# EAGLE design MOL-v2-1 (EAGLE 8.2.2)
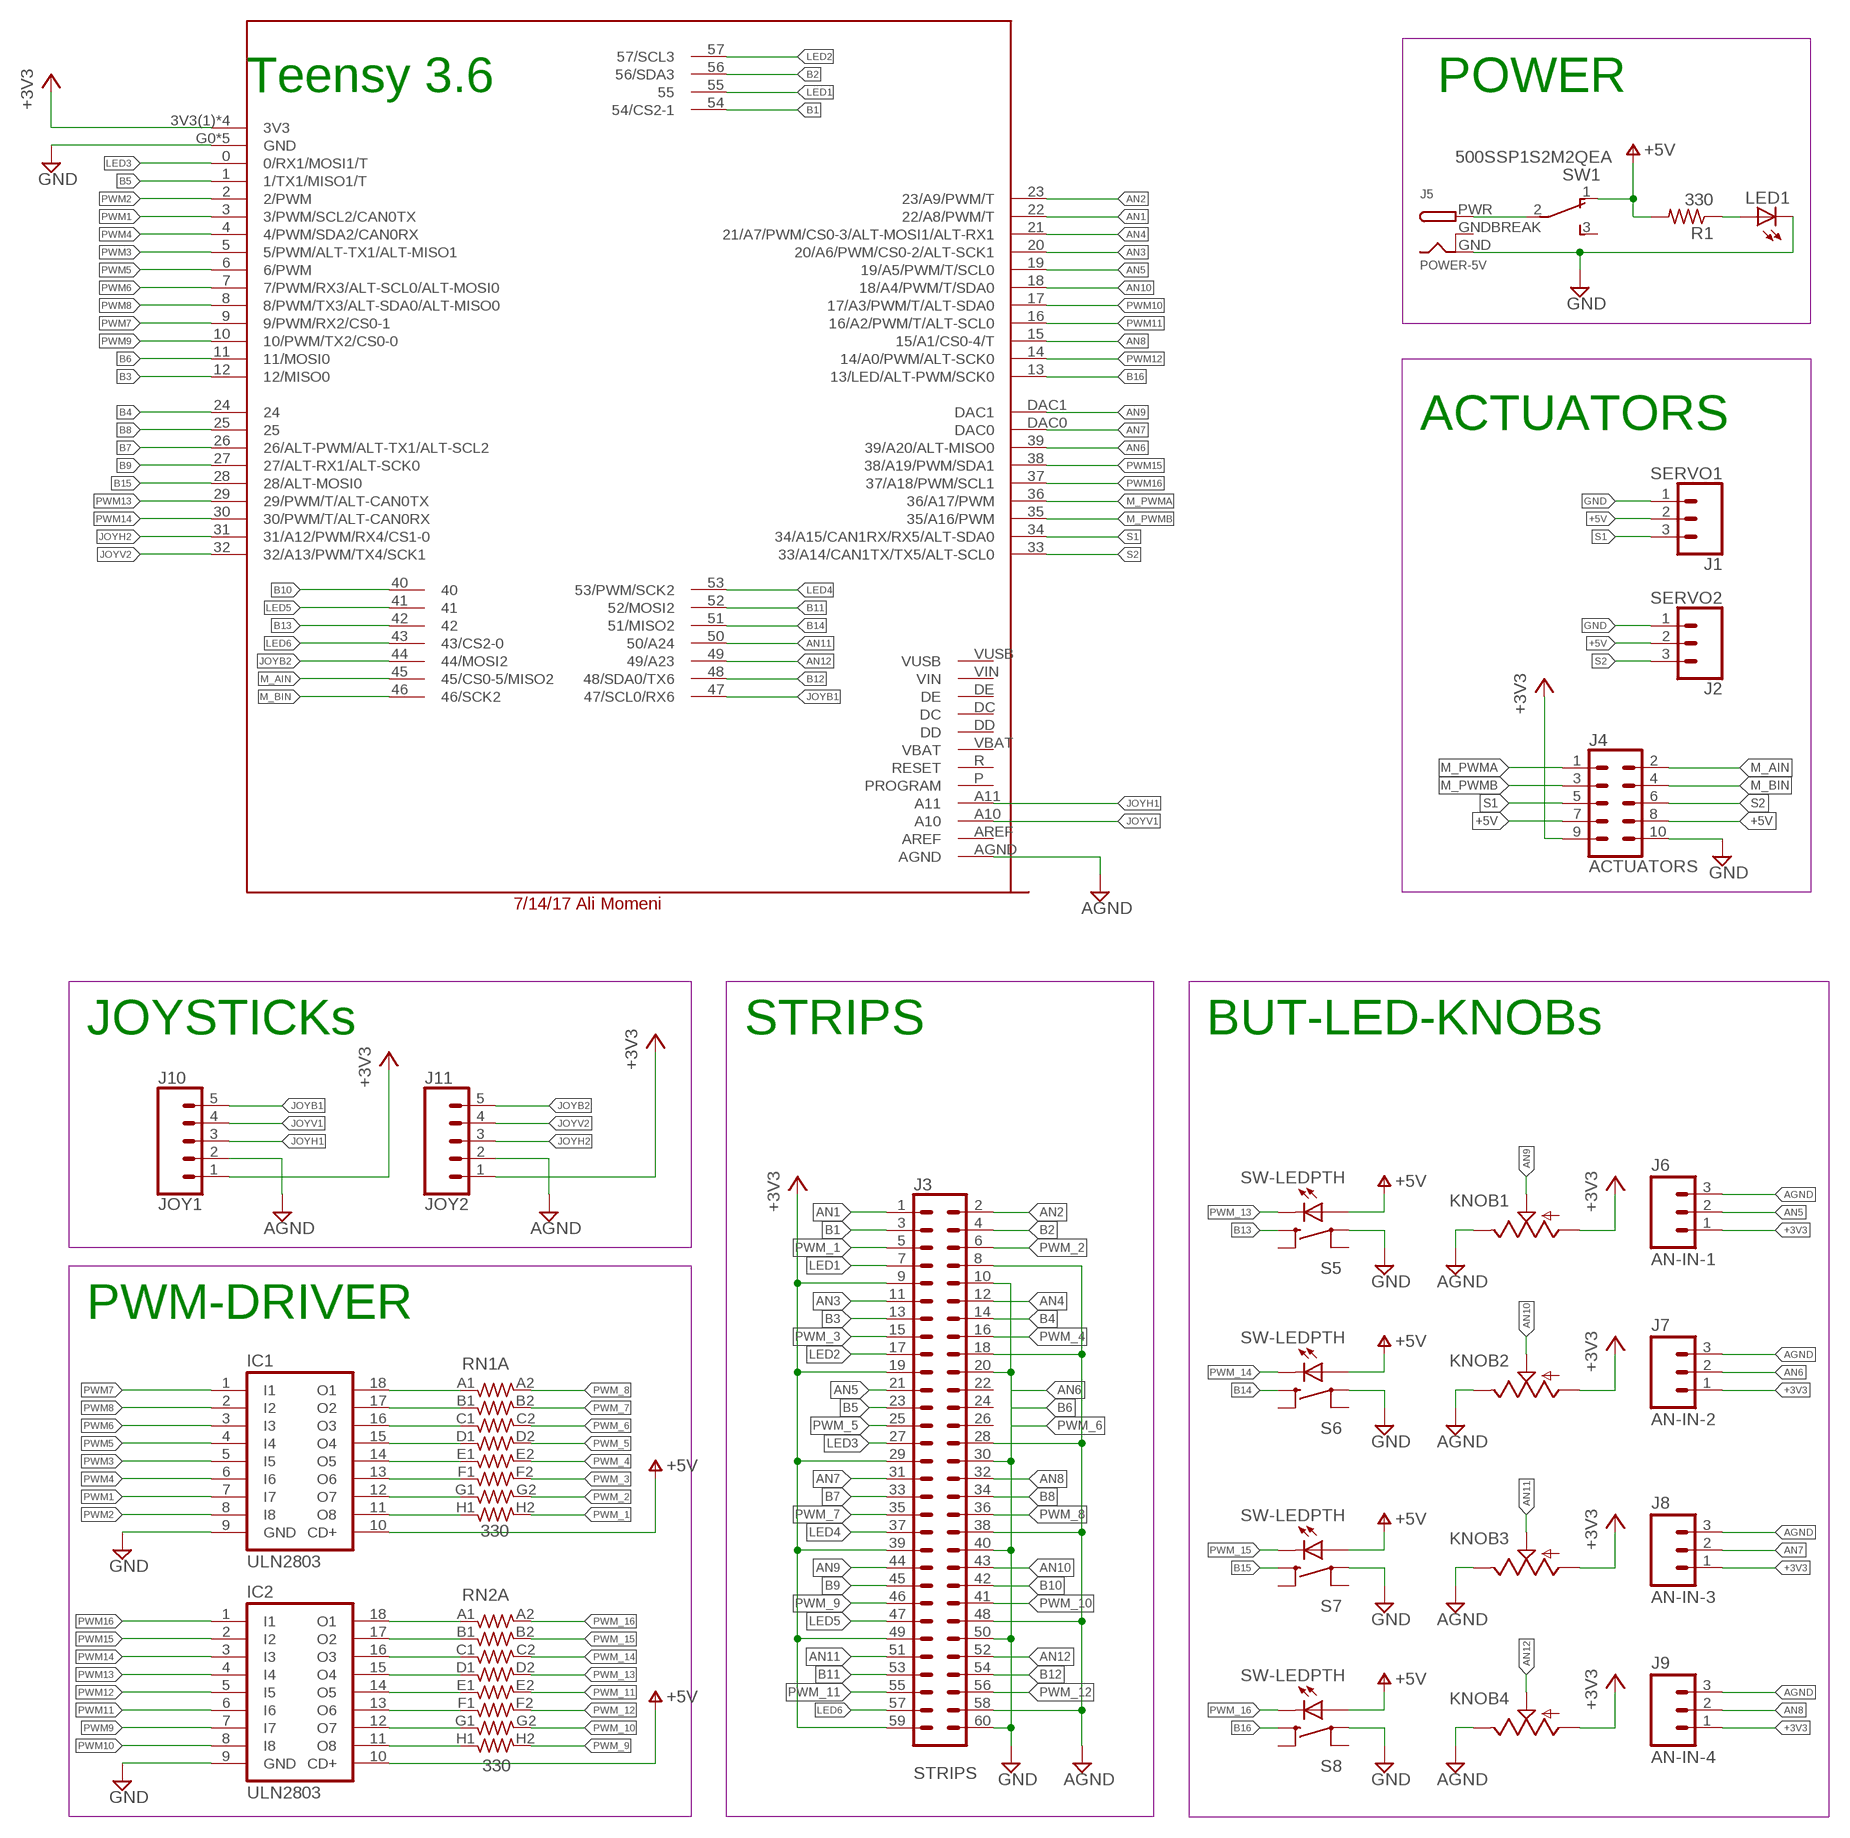
[diagram p0: schematic, sheet 1]

## Parts
IC1  ULN2803  ULN2803A  [DIL18]
IC2  ULN2803  ULN2803A  [DIL18]
J1  SERVO1  CONN_03LOCK  [1X03_LOCK@1]
J2  SERVO2  CONN_03LOCK  [1X03_LOCK@1]
J3  STRIPS  CONN_30X2  [2X30_SHROUDED]
J4  ACTUATORS  CONN_05X2SHD_LOCK  [2X5-SHROUDED_LOCK]
J5  POWER-5V  DCBARRELPTH  [DCJACK_2MM_PTH]
J6  AN-IN-1  M031X03_NO_SILK  [1X03_NO_SILK]
J7  AN-IN-2  M031X03_NO_SILK  [1X03_NO_SILK]
J8  AN-IN-3  M031X03_NO_SILK  [1X03_NO_SILK]
J9  AN-IN-4  M031X03_NO_SILK  [1X03_NO_SILK]
J10  JOY1  CONN_05LOCK  [1X05_LOCK]
J11  JOY2  CONN_05LOCK  [1X05_LOCK]
KNOB1  TRIM  [TRIM-PCB-9MM]
KNOB2  TRIM  [TRIM-PCB-9MM]
KNOB3  TRIM  [TRIM-PCB-9MM]
KNOB4  TRIM  [TRIM-PCB-9MM]
LED1  LED3MM  [LED3MM]
R1  330  R-US_0204/7  [0204/7]
RN1  330  RESISTOR-NET-8PDIL16  [RESISTOR-NET-8P-DIL16]
RN2  330  RESISTOR-NET-8PDIL16  [RESISTOR-NET-8P-DIL16]
S5  SW-LEDPTH  [TR2-SWITCH-MOMENTARY-LED]
S6  SW-LEDPTH  [TR2-SWITCH-MOMENTARY-LED]
S7  SW-LEDPTH  [TR2-SWITCH-MOMENTARY-LED]
S8  SW-LEDPTH  [TR2-SWITCH-MOMENTARY-LED]
SW1  500SSP1S2M2QEA  SWITCH_SPDT500SSP1S2M2QEA  [SWITCH_SPDT_500SSP1S2M2QEA]
U$1  TEENSY3_6-ALI_NO-USB-HOST  [TEENSY3-6_NO-USB-HOST]

## Nets
+3V3: J3.9 J3.19 J3.29 J3.39 J3.49 J3.59 J4.9 J6.1 J7.1 J8.1 J9.1 J10.1 J11.1 KNOB1.1(A) KNOB2.1(A) KNOB3.1(A) KNOB4.1(A) U$1.3V3(1)(3V3) U$1.3V3(2)(3V3) U$1.3V3(3)(3V3) U$1.3V3(4)(3V3)
+5V [Power]: IC1.10(CD+) IC2.10(CD+) J1.2 J2.2 J4.7 J4.8 R1.2 SW1.1 ; supply symbol labelled V+
AGND [Analog Sig]: J3.8 J3.18 J3.28 J3.38 J3.48 J3.58 J6.3 J7.3 J8.3 J9.3 J10.2 J11.2 KNOB1.3(E) KNOB2.3(E) KNOB3.3(E) KNOB4.3(E) U$1.AGND
AN1 [Analog Sig]: J3.1 U$1.22(22/A8/PWM/T)
AN2 [Analog Sig]: J3.2 U$1.23(23/A9/PWM/T)
AN3 [Analog Sig]: J3.11 U$1.20(20/A6/PWM/CS0-2/ALT-SCK1)
AN4 [Analog Sig]: J3.12 U$1.21(21/A7/PWM/CS0-3/ALT-MOSI1/ALT-RX1)
AN5 [Analog Sig]: J3.21 J6.2 U$1.19(19/A5/PWM/T/SCL0)
AN6 [Analog Sig]: J7.2 U$1.39(39/A20/ALT-MISO0)
AN7 [Analog Sig]: J3.31 J8.2 U$1.DAC0
AN8 [Analog Sig]: J3.32 J9.2 U$1.15(15/A1/CS0-4/T)
AN9 [Analog Sig]: J3.44 KNOB1.2(S) U$1.DAC1
AN10 [Analog Sig]: J3.43 KNOB2.2(S) U$1.18(18/A4/PWM/T/SDA0)
AN11 [Analog Sig]: J3.51 KNOB3.2(S) U$1.50(50/A24)
AN12 [Analog Sig]: J3.52 KNOB4.2(S) U$1.49(49/A23)
B1: J3.3 U$1.54(54/CS2-1)
B2: J3.4 U$1.56(56/SDA3)
B3: J3.13 U$1.12(12/MISO0)
B4: J3.14 U$1.24
B5: J3.23 U$1.1(1/TX1/MISO1/T)
B6: U$1.11(11/MOSI0)
B7: J3.33 U$1.26(26/ALT-PWM/ALT-TX1/ALT-SCL2)
B8: J3.34 U$1.25
B9: J3.45 U$1.27(27/ALT-RX1/ALT-SCK0)
B10: J3.42 U$1.40
B11: J3.53 U$1.52(52/MOSI2)
B12: J3.54 U$1.48(48/SDA0/TX6)
B13: S5.1 U$1.42
B14: S6.1 U$1.51(51/MISO2)
B15: S7.1 U$1.28(28/ALT-MOSI0)
B16: S8.1 U$1.13(13/LED/ALT-PWM/SCK0)
GND: IC1.9(GND) IC2.9(GND) J1.1 J2.1 J3.10 J3.20 J3.30 J3.40 J3.50 J3.60 J4.10 J5.GND LED1.K(C) S5.3 S6.3 S7.3 S8.3 U$1.G0(GND) U$1.G1(GND) U$1.G2(GND) U$1.G3(GND) U$1.G6(GND)
JOYB1: J10.5 U$1.47(47/SCL0/RX6)
JOYB2: J11.5 U$1.44(44/MOSI2)
JOYH1 [Analog Sig]: J10.3 U$1.A11
JOYH2 [Analog Sig]: J11.3 U$1.31(31/A12/PWM/RX4/CS1-0)
JOYV1 [Analog Sig]: J10.4 U$1.A10
JOYV2 [Analog Sig]: J11.4 U$1.32(32/A13/PWM/TX4/SCK1)
LED1: J3.7 U$1.55
LED2: J3.17 U$1.57(57/SCL3)
LED3: J3.27 U$1.0(0/RX1/MOSI1/T)
LED4: J3.37 U$1.53(53/PWM/SCK2)
LED5: J3.47 U$1.41
LED6: J3.57 U$1.43(43/CS2-0)
M_AIN: J4.2 U$1.45(45/CS0-5/MISO2)
M_BIN: J4.4 U$1.46(46/SCK2)
M_PWMA: J4.1 U$1.36(36/A17/PWM)
M_PWMB: J4.3 U$1.35(35/A16/PWM)
N$1: J5.PWR SW1.2
N$2: LED1.A R1.1
N$11: IC1.18(O1) RN1.A1
N$12: IC1.17(O2) RN1.B1
N$13: IC1.16(O3) RN1.C1
N$14: IC1.15(O4) RN1.D1
N$15: IC1.14(O5) RN1.E1
N$16: IC1.13(O6) RN1.F1
N$17: IC1.12(O7) RN1.G1
N$18: IC1.11(O8) RN1.H1
N$19: IC2.18(O1) RN2.A1
N$20: IC2.17(O2) RN2.B1
N$21: IC2.16(O3) RN2.C1
N$22: IC2.15(O4) RN2.D1
N$23: IC2.14(O5) RN2.E1
N$24: IC2.12(O7) RN2.G1
N$25: IC2.11(O8) RN2.H1
N$26: IC2.13(O6) RN2.F1
PWM1: IC1.7(I7) U$1.3(3/PWM/SCL2/CAN0TX)
PWM2: IC1.8(I8) U$1.2(2/PWM)
PWM3: IC1.5(I5) U$1.5(5/PWM/ALT-TX1/ALT-MISO1)
PWM4: IC1.6(I6) U$1.4(4/PWM/SDA2/CAN0RX)
PWM5: IC1.4(I4) U$1.6(6/PWM)
PWM6: IC1.3(I3) U$1.7(7/PWM/RX3/ALT-SCL0/ALT-MOSI0)
PWM7: IC1.1(I1) U$1.9(9/PWM/RX2/CS0-1)
PWM8: IC1.2(I2) U$1.8(8/PWM/TX3/ALT-SDA0/ALT-MISO0)
PWM9: IC2.7(I7) U$1.10(10/PWM/TX2/CS0-0)
PWM10: IC2.8(I8) U$1.17(17/A3/PWM/T/ALT-SDA0)
PWM11: IC2.6(I6) U$1.16(16/A2/PWM/T/ALT-SCL0)
PWM12: IC2.5(I5) U$1.14(14/A0/PWM/ALT-SCK0)
PWM13: IC2.4(I4) U$1.29(29/PWM/T/ALT-CAN0TX)
PWM14: IC2.3(I3) U$1.30(30/PWM/T/ALT-CAN0RX)
PWM15: IC2.2(I2) U$1.38(38/A19/PWM/SDA1)
PWM16: IC2.1(I1) U$1.37(37/A18/PWM/SCL1)
PWM_1: J3.5 RN1.H2
PWM_2: J3.6 RN1.G2
PWM_3: J3.15 RN1.F2
PWM_4: J3.16 RN1.E2
PWM_5: J3.25 RN1.D2
PWM_6: RN1.C2
PWM_7: J3.35 RN1.B2
PWM_8: J3.36 RN1.A2
PWM_9: J3.46 RN2.H2
PWM_10: J3.41 RN2.G2
PWM_11: J3.55 RN2.E2
PWM_12: J3.56 RN2.F2
PWM_13: RN2.D2 S5.C
PWM_14: RN2.C2 S6.C
PWM_15: RN2.B2 S7.C
PWM_16: RN2.A2 S8.C
S1: J1.3 J4.5 U$1.34(34/A15/CAN1RX/RX5/ALT-SDA0)
S2: J2.3 J4.6 U$1.33(33/A14/CAN1TX/TX5/ALT-SCL0)
V+: S5.A S6.A S7.A S8.A
Unconnected: J3.22 J3.24 J3.26 S5.2 S5.4 S6.2 S6.4 S7.2 S7.4 S8.2 S8.4 SW1.3 U$1.AREF U$1.DC U$1.DD U$1.DE U$1.P(PROGRAM) U$1.R(RESET) U$1.VBAT U$1.VIN U$1.VUSB

## Notes on the sheet
- Teensy 3.6 | POWER
- ACTUATORS
- JOYSTICKs | STRIPS | BUT-LED-KNOBs
- PWM-DRIVER

## Power pins joined to a net without a drawn wire
GNDBREAK: J5.GNDBREAK

## Library data of the parts
IC1 IC2 = uln-udn:ULN2803A: DRIVER ARRAY
J1 J2 = SparkFun-Connectors:CONN_03: Multi connection point. Often used as Generic Header-pin footprint for 0.1 inch spaced/style header connections On any of the 0.1 inch spaced packages, you can populate with these: Break Away Headers - Straight <https://www.sparkfun.com/products/116> (PRT-00116) Break Away Male Headers - Right Angle <https://www.sparkfun.com/products/553> (PRT-00553) Female Headers <https://www.sparkfun.com/products/115> (PRT-00115) Break Away Headers - Machine Pin <https://www.sparkfun.com/products/117> (PRT-00117) Break Away Female Headers - Swiss Machine Pin <https://www.sparkfun.com/products/743> (PRT-00743) Stackable Header - 3 Pin (Female, 0.1") <https://www.sparkfun.com/products/13875> (PRT-13875) For SCREWTERMINALS and SPRING TERMINALS visit here: Screw Terimnals on SparkFun.com <https://www.sparkfun.com/search/results?term=Screw+Terminals> (5mm/3.5mm/2.54mm spacing) This device is also useful as a general connection point to wire up your design to another part of your project. Our various solder wires solder well into these plated through hole pads. Hook-Up Wire - Assortment (Stranded, 22 AWG) <https://www.sparkfun.com/products/11375> (PRT-11375) Hook-Up Wire - Assortment (Solid Core, 22 AWG) <https://www.sparkfun.com/products/11367> (PRT-11367) View the entire wire category on our website here <https://www.sparkfun.com/categories/141> Special notes: Molex polarized connector foot print use with SKU : PRT-08232 with associated crimp pins and housings.
J3 = CMU-ArtFab:CONN_30X2
J4 = SparkFun-Connectors:CONN_05X2: Multi connection point. Often used as Generic Header-pin footprint for 0.1 inch spaced/style header connections For AVR SPI programming port, see special device with nice symbol: "AVR_SPI_PROG_5x2.dev" You can populate with any combo of single row headers, but if you'd like an exact match, check these: 2x5 AVR ICSP Male Header <https://www.sparkfun.com/products/778> (PRT-00778) 2x5 Pin Shrouded Header <https://www.sparkfun.com/products/8506> (PRT-08506) On any of the 0.1 inch spaced packages, you can populate with these: Break Away Headers - Straight <https://www.sparkfun.com/products/116> (PRT-00116) Break Away Male Headers - Right Angle <https://www.sparkfun.com/products/553> (PRT-00553) Female Headers <https://www.sparkfun.com/products/115> (PRT-00115) Break Away Headers - Machine Pin <https://www.sparkfun.com/products/117> (PRT-00117) Break Away Female Headers - Swiss Machine Pin <https://www.sparkfun.com/products/743> (PRT-00743) Special note: the shrouded connector mates well with our 5x2 ribbon cables: 2x5 Pin IDC Ribbon Cable <https://www.sparkfun.com/products/8535> (PRT-08535); PROD_ID: CONN-08671; SF_ID: PRT-08506
J5 = adafruit:DCBARREL: 2.0mm DC Barrel Jack DCJACK_2MM_PTH - Through Hole Jack (4UConnector: 05537)
J6-J9 = SparkFun-Connectors:M03: Header 3 Standard 3-pin 0.1" header. Use with straight break away headers (SKU : PRT-00116), right angle break away headers (PRT-00553), swiss pins (PRT-00743), machine pins (PRT-00117), and female headers (PRT-00115). Molex polarized connector foot print use with SKU : PRT-08232 with associated crimp pins and housings.
J10 J11 = SparkFun-Connectors:CONN_05: Multi connection point. Often used as Generic Header-pin footprint for 0.1 inch spaced/style header connections On any of the 0.1 inch spaced packages, you can populate with these: Break Away Headers - Straight <https://www.sparkfun.com/products/116> (PRT-00116) Break Away Male Headers - Right Angle <https://www.sparkfun.com/products/553> (PRT-00553) Female Headers <https://www.sparkfun.com/products/115> (PRT-00115) Break Away Headers - Machine Pin <https://www.sparkfun.com/products/117> (PRT-00117) Break Away Female Headers - Swiss Machine Pin <https://www.sparkfun.com/products/743> (PRT-00743) For SCREWTERMINALS and SPRING TERMINALS visit here: Screw Terimnals on SparkFun.com <https://www.sparkfun.com/search/results?term=Screw+Terminals> (5mm/3.5mm/2.54mm spacing) This device is also useful as a general connection point to wire up your design to another part of your project. Our various solder wires solder well into these plated through hole pads. Hook-Up Wire - Assortment (Stranded, 22 AWG) <https://www.sparkfun.com/products/11375> (PRT-11375) Hook-Up Wire - Assortment (Solid Core, 22 AWG) <https://www.sparkfun.com/products/11367> (PRT-11367) View the entire wire category on our website here <https://www.sparkfun.com/categories/141> Special notes: Molex polarized connector foot print use with SKU : PRT-08231 with associated crimp pins and housings. 1MM SMD Version SKU: PRT-10208
KNOB1-KNOB4 = Daniel:TRIM
LED1 = led:LED: LED OSRAM: - CHIPLED LG R971, LG N971, LY N971, LG Q971, LY Q971, LO R971, LY R971 LH N974, LH R974 LS Q976, LO Q976, LY Q976 LO Q996 - Hyper CHIPLED LW Q18S LB Q993, LB Q99A, LB R99A - SideLED LS A670, LO A670, LY A670, LG A670, LP A670 LB A673, LV A673, LT A673, LW A673 LH A674 LY A675 LS A676, LA A676, LO A676, LY A676, LW A676 LS A679, LY A679, LG A679 - Hyper Micro SIDELED® LS Y876, LA Y876, LO Y876, LY Y876 LT Y87S - SmartLED LW L88C, LW L88S LB L89C, LB L89S, LG L890 LS L89K, LO L89K, LY L89K LS L896, LA L896, LO L896, LY L896 - TOPLED LS T670, LO T670, LY T670, LG T670, LP T670 LSG T670, LSP T670, LSY T670, LOP T670, LYG T670 LG T671, LOG T671, LSG T671 LB T673, LV T673, LT T673, LW T673 LH T674 LS T676, LA T676, LO T676, LY T676, LB T676, LH T676, LSB T676, LW T676 LB T67C, LV T67C, LT T67C, LS T67K, LO T67K, LY T67K, LW E67C LS E67B, LA E67B, LO E67B, LY E67B, LB E67C, LV E67C, LT E67C LW T67C LS T679, LY T679, LG T679 LS T770, LO T770, LY T770, LG T770, LP T770 LB T773, LV T773, LT T773, LW T773 LH T774 LS E675, LA E675, LY E675, LS T675 LS T776, LA T776, LO T776, LY T776, LB T776 LHGB T686 LT T68C, LB T68C - Hyper Mini TOPLED® LB M676 - Mini TOPLED Santana® LG M470 LS M47K, LO M47K, LY M47K Source: http://www.osram.convergy.de LUXEON: - LUMILED® LXK2-PW12-R00, LXK2-PW12-S00, LXK2-PW14-U00, LXK2-PW14-V00 LXK2-PM12-R00, LXK2-PM12-S00, LXK2-PM14-U00 LXK2-PE12-Q00, LXK2-PE12-R00, LXK2-PE12-S00, LXK2-PE14-T00, LXK2-PE14-U00 LXK2-PB12-K00, LXK2-PB12-L00, LXK2-PB12-M00, LXK2-PB14-N00, LXK2-PB14-P00, LXK2-PB14-Q00 LXK2-PR12-L00, LXK2-PR12-M00, LXK2-PR14-Q00, LXK2-PR14-R00 LXK2-PD12-Q00, LXK2-PD12-R00, LXK2-PD12-S00 LXK2-PH12-R00, LXK2-PH12-S00 LXK2-PL12-P00, LXK2-PL12-Q00, LXK2-PL12-R00 Source: www.luxeon.com KINGBRIGHT: KA-3528ASYC Source: www.kingbright.com
R1 = resistor:R-US_: RESISTOR, American symbol
RN1 RN2 = CMU-ArtFab:RESISTOR-NET-8P: CTS 742 Series 16 Terminations, 8 Resistors
S5-S8 = Daniel:SW-LED: SWITCH PUSH SPST-NO 10MA 12V
SW1 = CMU-ArtFab:SWITCH_SPDT; DIGIKEY: EG5137-ND
U$1 = CMU-ArtFab:TEENSY3_6-ALI_NO-USB-HOST

## Net classes
2 Power: width 0.381 mm, clearance 0.279 mm
3 Analog Sig: width 0.381 mm, clearance 0.279 mm

## Board
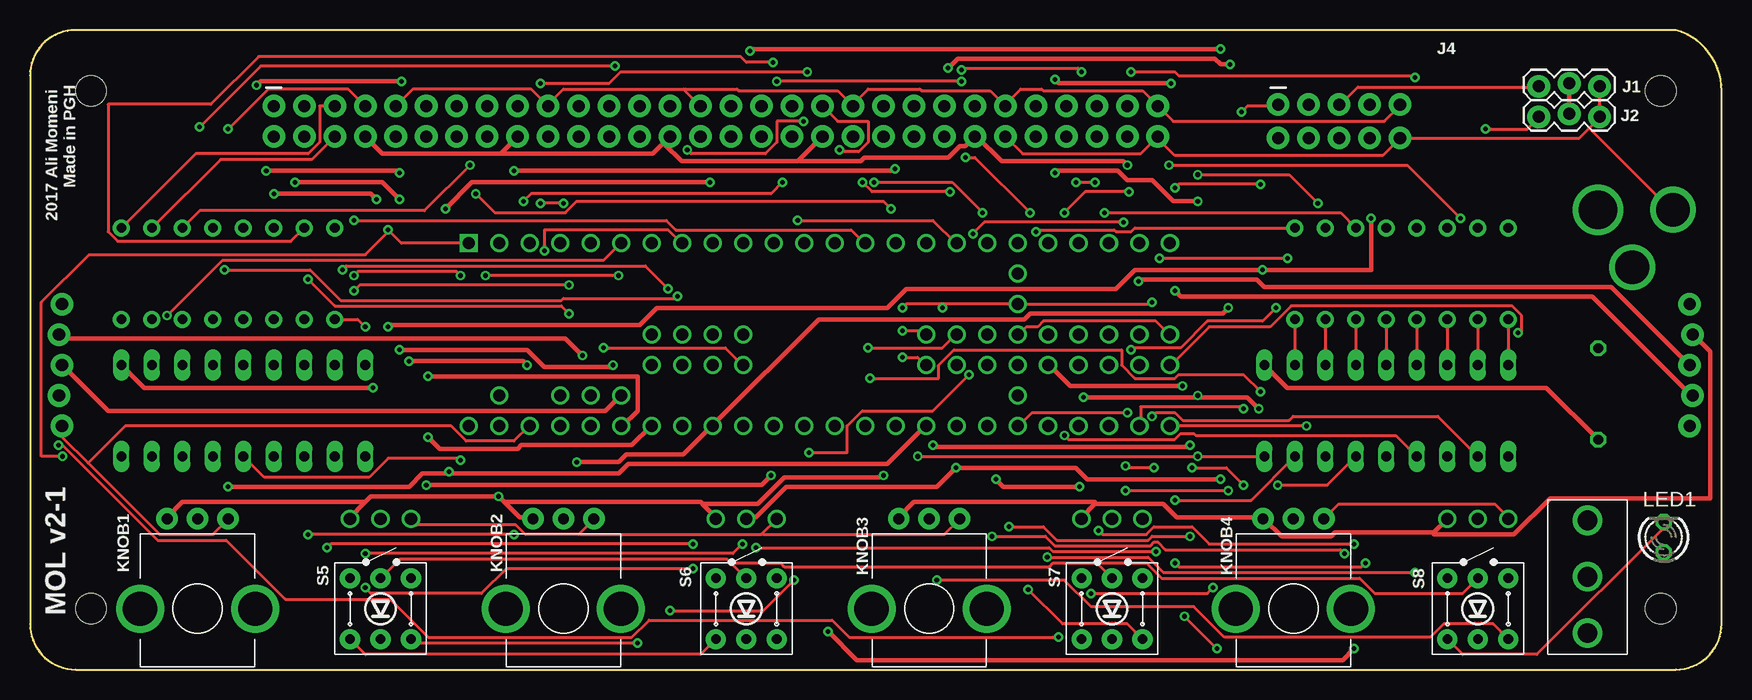
[diagram p1: board, top side]
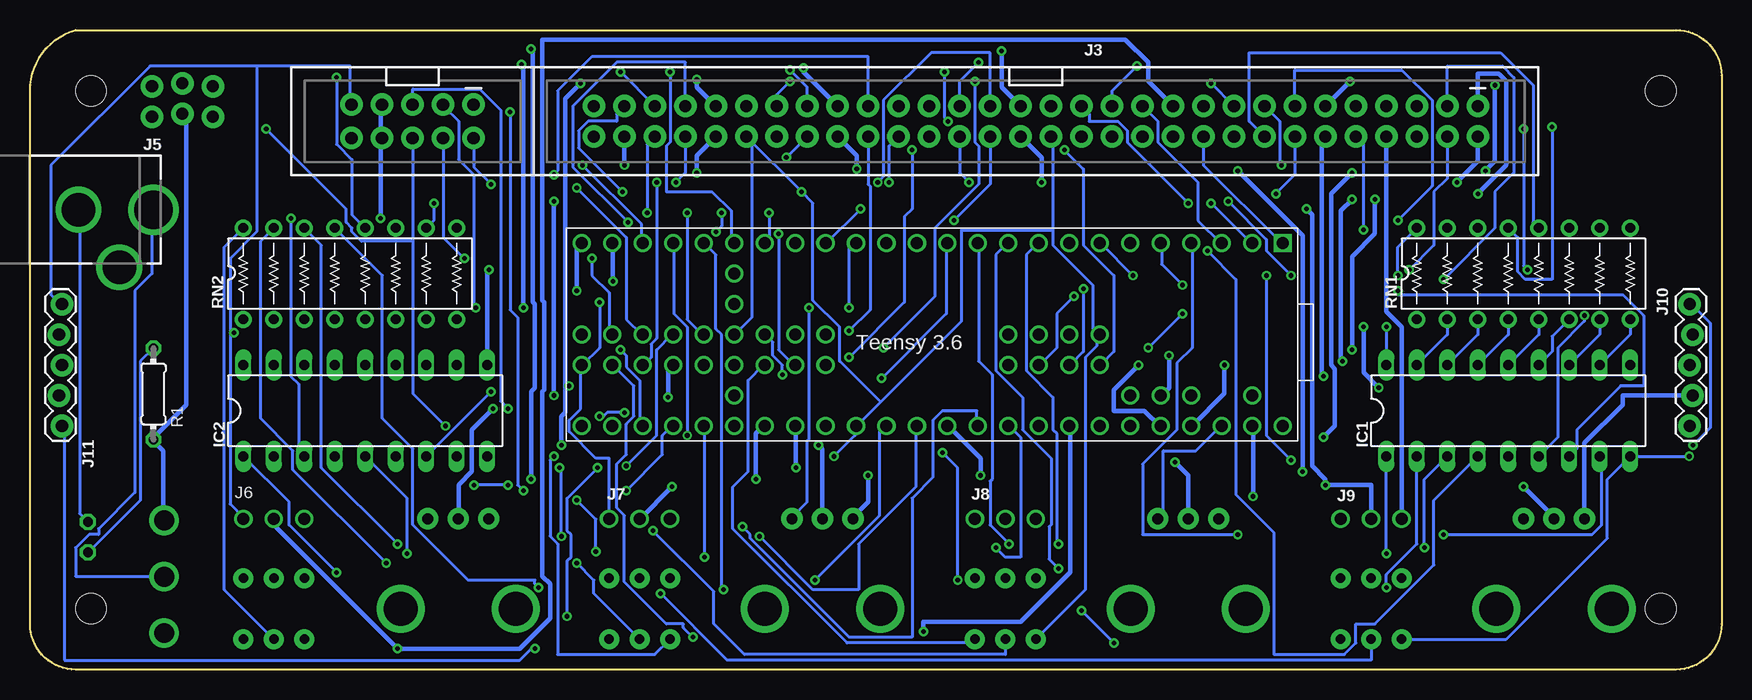
[diagram p2: board, bottom side, seen from below]

Size 140.97 x 53.34 mm. Coordinates in mm from the lower left corner, seen from the top.
Outline: 3.81,53.34 arc90 0,49.53 0,3.81 arc90 3.81,0 137.16,0 arc90 140.97,3.81 140.97,48.26 arc74 137.16,53.34 3.81,53.34
Copper layers (1*16): Top 0.035559375mm / dielectric 1.501140625mm / Bottom 0.035559375mm
Design rules "typical_4pcb": minimum track width 10mil, minimum drill 15mil, track to track 6mil, track to pad 6mil, pad to pad 6mil, via to via 6mil, smd to smd 6mil, copper to edge 15mil, drill to drill 8mil, minimum pad ring 10mil, minimum via ring 8mil, stop-mask expansion 4mil, vias tented up to drill 0mil, thermal gap 10mil
Holes 2.54 mm at 5.08,48.26 135.89,48.26 135.89,5.08 5.08,5.08

### Footprints (pad centres in the part's own frame; a part is rotated, then mirrored left to right if it is on the bottom)
DIL18 = drill 0.813 long: 1 -10.16,-3.81; 2 -7.62,-3.81; 3 -5.08,-3.81; 4 -2.54,-3.81; 5 0,-3.81; 6 2.54,-3.81; 7 5.08,-3.81; 8 7.62,-3.81; 9 10.16,-3.81; 10 10.16,3.81; 11 7.62,3.81; 12 5.08,3.81; 13 2.54,3.81; 14 0,3.81; 15 -2.54,3.81; 16 -5.08,3.81; 17 -7.62,3.81; 18 -10.16,3.81
1X03_LOCK@1 = drill 1.016 pad 1.88: 1 0,0.127; 2 2.54,-0.127; 3 5.08,0.127
2X30_SHROUDED = drill 1.016 pad 1.88: 1 -1.27,36.83; 2 1.27,36.83; 3 -1.27,34.29; 4 1.27,34.29; 5 -1.27,31.75; 6 1.27,31.75; 7 -1.27,29.21; 8 1.27,29.21; 9 -1.27,26.67; 10 1.27,26.67; 11 -1.27,24.13; 12 1.27,24.13; 13 -1.27,21.59; 14 1.27,21.59; 15 -1.27,19.05; 16 1.27,19.05; 17 -1.27,16.51; 18 1.27,16.51; 19 -1.27,13.97; 20 1.27,13.97; 21 -1.27,11.43; 22 1.27,11.43; 23 -1.27,8.89; 24 1.27,8.89; 25 -1.27,6.35; 26 1.27,6.35; 27 -1.27,3.81; 28 1.27,3.81; 29 -1.27,1.27; 30 1.27,1.27; 31 -1.27,-1.27; 32 1.27,-1.27; 33 -1.27,-3.81; 34 1.27,-3.81; 35 -1.27,-6.35; 36 1.27,-6.35; 37 -1.27,-8.89; 38 1.27,-8.89; 39 -1.27,-11.43; 40 1.27,-11.43; 41 -1.27,-13.97; 42 1.27,-13.97; 43 -1.27,-16.51; 44 1.27,-16.51; 45 -1.27,-19.05; 46 1.27,-19.05; 47 -1.27,-21.59; 48 1.27,-21.59; 49 -1.27,-24.13; 50 1.27,-24.13; 51 -1.27,-26.67; 52 1.27,-26.67; 53 -1.27,-29.21; 54 1.27,-29.21; 55 -1.27,-31.75; 56 1.27,-31.75; 57 -1.27,-34.29; 58 1.27,-34.29; 59 -1.27,-36.83; 60 1.27,-36.83
2X5-SHROUDED_LOCK = drill 1.016 pad 1.88: 1 -1.397,5.08; 2 1.397,5.08; 3 -1.397,2.54; 4 1.397,2.54; 5 -1.397,0; 6 1.397,0; 7 -1.397,-2.54; 8 1.397,-2.54; 9 -1.397,-5.08; 10 1.397,-5.08
DCJACK_2MM_PTH = drill 2.8: GND 0,7.35; GNDBREAK 4.8,10.75 | drill 3.2: PWR 0,13.6
1X03_NO_SILK = drill 1.016 pad 1.524: 1 0,0; 2 2.54,0; 3 5.08,0
1X05_LOCK = drill 1.016 pad 1.88: 1 0,0.127; 2 2.54,-0.127; 3 5.08,0.127; 4 7.62,-0.127; 5 10.16,0.127
TRIM-PCB-9MM = drill 0.9 pad 1.778: 1 -2.54,-7.5; 2 0,-7.5; 3 2.54,-7.5 | drill 2.845 pad 4: 5 -4.8,0; M2 4.8,0
LED3MM = drill 0.813 octagon: A -1.27,0; K 1.27,0
0204/7 = drill 0.813 octagon: 1 -3.81,0; 2 3.81,0
RESISTOR-NET-8P-DIL16 = drill 0.813 pad 1.422: A1 -8.89,-3.81; A2 -8.89,3.81; B1 -6.35,-3.81; B2 -6.35,3.81; C1 -3.81,-3.81; C2 -3.81,3.81; D1 -1.27,-3.81; D2 -1.27,3.81; E1 1.27,-3.81; E2 1.27,3.81; F1 3.81,-3.81; F2 3.81,3.81; G1 6.35,-3.81; G2 6.35,3.81; H1 8.89,-3.81; H2 8.89,3.81
TR2-SWITCH-MOMENTARY-LED = drill 0.8 pad 1.676: 1 2.54,-2.54; 2 2.54,2.54; 3 -2.54,-2.54; 4 -2.54,2.54; A 0,2.54; C 0,-2.54
SWITCH_SPDT_500SSP1S2M2QEA = drill 1.65: 1 -4.7,0; 2 0,0; 3 4.7,0
TEENSY3-6_NO-USB-HOST = drill 1: 0 3.81,1.27; 1 6.35,1.27; 2 8.89,1.27; 3 11.43,1.27; 3V3(1) 36.83,1.27; 3V3(2) 46.99,6.35; 3V3(3) 6.35,16.51; 3V3(4) 59.69,11.43; 4 13.97,1.27; 5 16.51,1.27; 6 19.05,1.27; 7 21.59,1.27; 8 24.13,1.27; 9 26.67,1.27; 10 29.21,1.27; 11 31.75,1.27; 12 34.29,1.27; 13 34.29,16.51; 14 31.75,16.51; 15 29.21,16.51; 16 26.67,16.51; 17 24.13,16.51; 18 21.59,16.51; 19 19.05,16.51; 20 16.51,16.51; 21 13.97,16.51; 22 11.43,16.51; 23 8.89,16.51; 24 39.37,1.27; 25 41.91,1.27; 26 44.45,1.27; 27 46.99,1.27; 28 49.53,1.27; 29 52.07,1.27; 30 54.61,1.27; 31 57.15,1.27; 32 59.69,1.27; 33 59.69,16.51; 34 57.15,16.51; 35 54.61,16.51; 36 52.07,16.51; 37 49.53,16.51; 38 46.99,16.51; 39 44.45,16.51; 40 39.37,8.89; 41 41.91,8.89; 42 44.45,8.89; 43 49.53,8.89; 44 52.07,8.89; 45 54.61,8.89; 46 57.15,8.89; 47 57.15,11.43; 48 54.61,11.43; 49 52.07,11.43; 50 49.53,11.43; 51 44.45,11.43; 52 41.91,11.43; 53 39.37,11.43; 54 24.13,11.43; 55 21.59,11.43; 56 19.05,11.43; 57 16.51,11.43; A10 11.43,13.97; A11 13.97,13.97; AGND 3.81,16.51; AREF 8.89,13.97; DAC0 41.91,16.51; DAC1 39.37,16.51; DC 21.59,8.89; DD 24.13,8.89; DE 19.05,8.89; G1 46.99,8.89; G2 36.83,16.51; G3 59.69,8.89; G6 16.51,8.89; P 46.99,11.43; R 46.99,13.97; VBAT 46.99,3.81; VIN 1.27,16.51; VUSB 3.81,13.97 | drill 1 square: G0 1.27,1.27

### Placement (x,y rotation side)
IC1  17.78,21.59 0 bottom
IC2  113.03,21.59 0 bottom
J1  130.81,48.77 180 top
J2  130.81,46.23 180 top
J3  57.15,45.72 270 bottom
J4  109.09,45.72 270 bottom
J5  144.27,38.35 270 bottom
J6  123.19,12.57 0 bottom
J7  92.71,12.57 0 bottom
J8  62.23,12.57 0 bottom
J9  31.75,12.57 0 bottom
J10  2.54,20.32 90 bottom
J11  138.43,30.48 270 bottom
KNOB1  13.97,5.08 180 top
KNOB2  44.45,5.08 180 top
KNOB3  74.93,5.08 180 top
KNOB4  105.28,5.08 180 top
LED1  136.14,11.05 90 top
R1  130.68,22.99 270 bottom
RN1  16.51,33.02 0 bottom
RN2  114.3,33.02 0 bottom
S5  29.21,5.08 0 top
S6  59.69,5.08 0 top
S7  90.17,5.08 0 top
S8  120.65,5.08 0 top
SW1  129.79,7.75 270 top
U$1  35.31,36.83 180 bottom

### Tracks (layer width: path | path; a pad name or v marks a point on that pad's centre or on a via)
+3V3  (via drill 0.38)
  Top 0.254: v72.71,30.16 73.03,30.48 76.04,30.48 | 76.04,30.48 U$1.3V3(2) 93.34,30.48 v93.5,30.64 | 4.84,17.22 2.7,19.37 2.7,20.32 J10.1 | 4.84,17.22 10.79,11.27 15.24,11.27 16.51,12.54 KNOB1.1 | 45.8,11.35 46.99,12.54 KNOB2.1 | 45.8,11.35 45.72,11.27 41.27,11.27 40.48,12.06 32.23,12.06 31.75,12.54 J9.1 | 61.04,11.35 60.96,11.27 45.88,11.27 45.8,11.35 | 61.04,11.35 62.23,12.54 J8.1 | KNOB3.1 77.47,12.54 76.2,11.27 61.12,11.27 61.04,11.35 | 4.84,17.22 7.94,20.32 35.08,20.32 36.35,19.05 40.32,19.05 41.59,20.32 U$1.3V3(3) | v76.04,30.16 76.04,30.48 | J6.1 123.19,12.7 122.08,13.81 109.06,13.81 107.95,12.7 KNOB4.1 | J3.9 31.91,48.42 41.75,48.42 J3.19 43.18,47.15 44.45,48.42 54.45,48.42 54.53,48.34 | 54.53,48.34 J3.29 | 54.53,48.34 54.61,48.42 58.9,48.42 59.05,48.26 67.31,48.26 J3.39 68.58,47.15 69.85,48.42 74.14,48.42 74.3,48.26 80.01,48.26 J3.49 81.28,47.15 82.55,48.42 84.3,48.42 84.45,48.26 92.71,48.26 J3.59 95.25,45.72 112.87,45.72 114.14,46.99 J4.9 | v123.98,28.1 124.3,28.1 124.3,29.53 123.51,30.32 105.09,30.32 103.35,28.57 98.27,28.57 95.09,25.4 U$1.3V3(4)
  Bottom 0.254: J7.1 92.71,17.62 93.82,17.62 96.04,19.84 96.04,20.8 95.09,21.75 95.09,25.4 U$1.3V3(4) 94.93,25.4 93.5,26.83 v93.5,30.64 | v72.71,30.16 72.71,35.08 72.23,35.56 U$1.3V3(1) | U$1.3V3(3) 41.75,20.32 43.81,18.26 46.51,18.26 46.51,13.18 46.99,12.7 KNOB2.1 | v76.04,30.16 76.04,19.21 76.2,19.05 76.2,13.97 77.47,12.7 KNOB3.1 | 122.08,50.32 114.3,50.32 114.3,47.15 J4.9 | 122.08,50.32 130.97,50.32 139.22,42.07 139.22,31.27 138.43,30.48 J11.1 | 124.3,28.1 124.3,34.29 122.08,36.51 122.08,50.32 | 124.3,28.1 124.3,13.81 123.19,12.7 J6.1 | 124.3,28.1 v123.98,28.1
+5V  (via drill 0.38)
  Top 0.381: J1.2 J2.2 | IC1.10 9.53,23.5 v28.57,23.5 | v29.84,28.57 30,28.73 50.8,28.73 52.23,30.16 71.44,30.16 73.03,31.75 90.49,31.75 92.08,33.34 v102.71,33.34 111.76,33.34 v111.76,37.62 | R1.2 126.36,23.5 104.78,23.5 IC2.10
  Bottom 0.381: SW1.1 129.86,12.54 129.86,18.26 130.65,19.05 R1.2 130.65,19.37 127.95,22.07 127.95,46.04 J2.2 | J4.7 111.76,46.99 111.76,44.45 J4.8 111.76,44.29 v111.76,37.62 | v28.57,23.5 29.84,24.77 v29.84,28.57 | v102.71,33.34 102.87,33.18 IC2.10
AGND  (via drill 0.38)
  Top 0.381: 88.74,13.81 87.63,12.7 J7.3 | 88.74,13.81 94.46,13.81 95.57,12.7 102.71,12.7 KNOB4.3 102.87,12.54 104.3,11.11 108.43,11.11 108.74,11.43 117,11.43 | 117,11.43 118.11,12.54 J6.3 | KNOB3.3 72.39,12.7 73.66,13.97 88.74,13.97 88.74,13.81 | J11.2 138.59,27.94 140.02,26.51 140.02,14.29 126.68,14.29 123.67,11.27 117,11.27 117,11.43 | J3.8 29.37,43.02 39.21,43.02 | J3.18 39.21,43.02 | 39.21,43.02 51.91,43.02 J3.28 52.86,43.81 54.29,42.39 63.98,42.39 64.06,42.47 | 64.06,42.47 J3.38 | 64.06,42.47 64.14,42.39 69.22,42.39 69.53,42.7 76.52,42.7 77.47,43.66 77.95,43.66 J3.48 78.9,44.45 80.96,42.39 91.12,42.39 v91.44,42.07 | 39.61,13.89 40.8,12.7 41.91,12.7 KNOB2.3 | 39.61,13.89 v39.05,14.45 28.42,14.45 27.86,13.89 | 27.86,13.89 26.67,12.7 J9.3 | 56.12,13.73 55.88,13.97 39.69,13.97 39.61,13.89 | 56.12,13.73 57.15,12.7 J8.3 | KNOB1.3 11.43,12.7 12.7,13.97 27.78,13.97 27.86,13.89 | v71.12,16.19 70.96,16.03 62.87,16.03 60.64,13.81 56.2,13.81 56.12,13.73
  Bottom 0.381: v91.44,42.07 J3.58 | v39.05,14.45 39.05,20.32 U$1.AGND | J10.2 8.26,22.86 8.26,22.07 11.43,18.89 KNOB1.3 | J3.8 27.94,29.84 26.67,28.57 J9.3 | v71.12,16.19 71.12,13.97 72.39,12.7 KNOB3.3
AN1  (via drill 0.38)
  Top 0.381: v48.58,25.4 48.42,25.24 42.86,25.24 41.43,26.67 v30.8,26.67 | v28.89,39.21 28.42,39.69 v20.32,39.69
  Bottom 0.381: v48.58,25.4 50.64,23.34 50.64,21.59 48.1,21.59 46.83,20.32 U$1.22 | v30.8,26.67 30.8,34.45 28.89,36.35 v28.89,39.21 | v20.32,39.69 17.94,42.07 17.94,49.05 18.57,49.69 20.32,49.69 J3.1
AN2  (via drill 0.38)
  Top 0.381: v41.43,25.4 41.12,25.72 v31.59,25.72 | v30.8,39.21 29.37,40.64 v22.07,40.64
  Bottom 0.381: v41.43,25.4 41.43,23.02 44.13,20.32 U$1.23 | v31.59,25.72 31.75,25.88 31.75,38.26 v30.8,39.21 | v22.07,40.64 20.32,42.39 J3.2
AN3  (via drill 0.38)
  Top 0.381: v33.18,19.37 34.13,18.41 40.64,18.41 40.96,18.73 50.16,18.73 51.75,20.32 U$1.20 | v30.8,41.43 30.64,41.59 v19.68,41.59 | v18.89,48.74 19.21,49.05 v30.96,49.05
  Bottom 0.381: v33.18,19.37 32.23,20.32 32.23,25.08 32.54,25.4 32.54,39.69 v30.8,41.43 | v19.68,41.59 18.89,42.39 v18.89,48.74 | J3.11 v30.96,49.05
AN4  (via drill 0.38)
  Top 0.381: v33.18,24.45 50.64,24.45 50.64,21.59 49.37,20.32 U$1.21
  Bottom 0.381: v33.18,24.45 33.34,24.61 33.34,44.13 J3.12
AN5  (via drill 0.38)
  Top 0.381: v66.52,3.17 68.9,0.79 109.38,0.79 v110.33,1.75
  Bottom 0.381: v66.52,3.17 66.52,3.97 58.42,3.97 54.29,8.1 54.29,20.32 U$1.19 | J6.2 120.65,12.06 v110.33,1.75 100.17,1.75 97.63,4.29 97.63,7.14 98.27,7.78 98.27,23.18 98.11,23.34 98.11,30.64 98.27,30.8 98.27,52.55 49.69,52.55 47.78,50.64 47.78,49.05 J3.21
AN6  (via drill 0.38)
  Top 0.381: v80.49,15.88 81.12,15.24 v87.47,15.24
  Bottom 0.381: v80.49,15.88 80.49,19.68 79.85,20.32 U$1.39 | v87.47,15.24 90.17,12.54 J7.2
AN7  (via drill 0.38)
  Top 0.381: J8.2 59.69,12.7 60.48,12.7 63.02,15.24 75.56,15.24 v77.15,16.83 87.15,16.83 88.11,15.88 v99.22,15.88 | v60.01,51.59 60.17,51.75 v99.22,51.75
  Bottom 0.381: v77.15,16.83 77.15,20.32 U$1.DAC0 | J3.31 60.01,48.58 v60.01,51.59 | v99.22,51.75 99.06,51.59 99.06,30.64 98.9,30.48 98.9,23.5 99.22,23.18 v99.22,15.88
AN8  (via drill 0.38)
  Top 0.381: v61.75,16.19 60.96,15.4 v33.02,15.4 | v56.67,40.64 36.83,40.64 v34.61,38.42
  Bottom 0.381: v61.75,16.19 61.75,17.62 64.45,20.32 U$1.15 | J9.2 29.21,15.4 v33.02,15.4 33.02,15.88 34.13,16.99 34.13,37.94 v34.61,38.42 | J3.32 56.67,42.7 v56.67,40.64
AN9  (via drill 0.38)
  Top 0.381: 34.92,16.35 32.7,16.35 31.59,15.24 v16.51,15.24 | 34.92,16.35 49.05,16.35 49.85,17.14 71.44,17.14 74.61,20.32 U$1.DAC1 | v72.07,41.75 71.91,41.59 v40.32,41.59 | v34.92,16.51 34.92,16.35
  Bottom 0.381: v16.51,15.24 13.97,12.7 KNOB1.2 | J3.44 72.07,42.86 v72.07,41.75 | v40.32,41.59 34.92,36.2 v34.92,16.51
AN10  (via drill 0.38)
  Top 0.381: v45.56,17.3 49.05,17.3 49.69,17.94 54.45,17.94 56.83,20.32 U$1.18 56.99,20.48 65.72,29.21 82.87,29.21 83.34,29.69 99.38,29.69 v99.85,30.16 | v76.52,50.16 77.31,50.96 98.74,50.96 99.22,50.48 v100.01,50.48
  Bottom 0.381: v45.56,17.3 44.45,16.19 KNOB2.2 | J3.43 76.52,49.85 v76.52,50.16 | v100.01,50.48 99.85,50.32 v99.85,30.16
AN11  (via drill 0.38)
  Top 0.381: v96.04,23.65 86.68,23.65 84.93,25.4 U$1.50 | v96.68,18.73 96.52,18.57 75.41,18.57 v75.25,18.73 | v85.41,49.21 85.72,48.9 v95.09,48.9
  Bottom 0.381: v96.68,18.73 96.68,21.11 96.36,21.43 96.36,23.34 v96.04,23.65 96.36,23.5 96.36,47.62 v95.09,48.9 | v75.25,18.73 74.93,18.41 KNOB3.2 | J3.51 85.41,48.58 v85.41,49.21
AN12  (via drill 0.38)
  Top 0.381: 97.31,22.7 101.44,22.7 v102.39,21.75 | 97.31,22.7 v87.79,22.7 | v85.41,41.43 85.57,41.59 90.65,41.59 91.44,40.8 93.5,40.8 95.25,39.05 v97.31,39.05 | v97.31,22.86 97.31,22.7
  Bottom 0.381: v87.79,22.7 87.79,25.08 87.47,25.4 U$1.49 | v102.39,21.75 104.14,20 104.14,16.51 105.25,15.4 105.25,12.7 KNOB4.2 | J3.52 85.41,42.86 v85.41,41.43 | v97.31,22.86 v97.31,39.05
B1  (via drill 0.38)
  Top 0.254: v47.78,26.83 57.94,26.83 59.37,25.4 U$1.54 | v44.93,29.69 44.29,30.32 25.4,30.32 v23.18,32.54
  Bottom 0.254: v44.93,29.69 v47.78,26.83 | v23.18,32.54 18.89,36.83 18.89,39.85 17.3,41.43 17.3,49.37 18.26,50.32 22.86,50.32 J3.3
B2  (via drill 0.38)
  Top 0.254: v53.18,31.75 51.28,33.66 26.35,33.66 v26.04,33.34
  Bottom 0.254: v53.18,31.75 53.18,26.51 54.29,25.4 U$1.56 | v26.04,33.34 23.97,35.4 23.97,39.85 22.86,40.96 J3.4
B3  (via drill 0.38)
  Top 0.254: v26.99,37.47 53.02,37.47 53.82,36.67 68.42,36.67 69.53,35.56 U$1.12
  Bottom 0.254: v26.99,37.47 24.13,40.32 24.13,47.47 26.67,50.01 35.56,50.01 J3.13
B4  (via drill 0.38)
  Top 0.254: v71.75,38.42 71.12,39.05 45.56,39.05 44.61,38.1 38.73,38.1 v37.15,39.69
  Bottom 0.254: v71.75,38.42 74.61,35.56 U$1.24 | v37.15,39.69 35.56,41.27 J3.14
B5
  Bottom 0.254: J3.23 46.99,45.72 46.99,43.97 43.66,40.64 43.66,37.47 41.75,35.56 U$1.1
B7  (via drill 0.38)
  Top 0.254: v79.38,38.1 76.83,40.64 v70.33,40.64
  Bottom 0.254: v79.38,38.1 79.38,35.88 79.69,35.56 U$1.26 | v70.33,40.64 69.85,41.12 69.85,47.47 65.88,51.44 60.96,51.44 J3.33
B8  (via drill 0.38)
  Top 0.254: v63.98,37.47 75.25,37.47 77.15,35.56 U$1.25
  Bottom 0.254: v63.98,37.47 60.96,40.48 J3.34
B9  (via drill 0.38)
  Top 0.254: v87.63,49.85 87.31,50.16 77.79,50.16 v77.63,50.01
  Bottom 0.254: v87.63,49.85 87.63,43.97 87.95,43.66 87.95,39.85 84.14,39.85 82.55,38.26 82.55,35.72 82.39,35.56 U$1.27 | v77.63,50.01 76.2,48.58 J3.45
B10  (via drill 0.38)
  Top 0.254: v72.71,28.26 74.3,28.26 74.61,27.94 U$1.40
  Bottom 0.254: v72.71,28.26 70.96,30 70.96,40.32 71.12,40.48 J3.42
B11  (via drill 0.38)
  Top 0.254: v78.58,36.35 79.53,37.31 v91.12,37.31
  Bottom 0.254: v78.58,36.35 78.58,26.67 77.31,25.4 U$1.52 | v91.12,37.31 95.73,41.91 95.73,46.99 92.08,50.64 86.36,50.64 J3.53
B12  (via drill 0.38)
  Top 0.254: v87.15,40.64 v88.74,40.64
  Bottom 0.254: v88.74,40.64 88.74,27.62 89.22,27.15 89.22,26.04 89.85,25.4 U$1.48 | v87.15,40.64 86.36,41.43 J3.54
B13  (via drill 0.38)
  Top 0.254: v78.26,24.61 75.25,21.59 69.37,21.59 68.1,20.32 68.1,18.1 v64.93,18.1 | v63.66,7.46 61.12,4.92 v53.34,4.92 | v50.64,2.22 32.07,2.22 S5.1
  Bottom 0.254: v78.26,24.61 78.26,25.4 79.06,26.19 79.06,27.3 79.69,27.94 U$1.42 | v64.93,18.1 63.66,16.83 v63.66,7.46 | v50.64,2.22 v53.34,4.92
B14
  Bottom 0.254: S6.1 62.23,2.22 72.87,2.22 82.39,11.75 82.39,15.24 81.12,16.51 81.12,24.13 79.85,25.4 U$1.51
B15  (via drill 0.38)
  Top 0.254: v83.19,6.67 86.04,3.81 91.44,3.81 S7.1
  Bottom 0.254: v83.19,6.67 83.34,6.83 83.34,27.94 83.82,28.42 83.82,34.61 84.77,35.56 U$1.28
B16  (via drill 0.38)
  Top 0.254: v75.56,7.46 86.2,7.46 88.42,5.24 97,5.24 99.54,2.7 116.68,2.7 117.79,3.81 121.92,3.81 S8.1
  Bottom 0.254: v75.56,7.46 70.17,12.86 70.17,19.84 69.69,20.32 U$1.13
GND  (via drill 0.38)
  Top 0.254: U$1.G1 82.39,27.94 83.03,28.57 83.98,28.57 84.45,29.05 93.82,29.05 94.93,27.94 U$1.G3 | v69.37,40.64 70.17,39.85 v76.68,39.85 | J3.50 82.71,43.02 92.55,43.02 J3.60 93.98,44.29 95.41,42.86 112.71,42.86 J4.10 114.3,44.29 129.06,44.29 129.94,45.16 | 129.94,45.16 130.81,46.04 J2.1 J1.1 | S8.3 119.38,1.27 125.57,1.27 136.05,11.75 136.05,12.22 LED1.K | 129.94,45.16 136.68,38.42 136.84,38.42 J5.GND | U$1.G0 30.96,35.56 v29.84,36.67 29.84,36.51 27.94,34.61 4.92,34.61 0.95,30.64 0.95,17.78 v2.7,17.78 | v73.98,17.78 v97.31,17.78 IC2.9 | S5.3 27.94,1.27 55.88,1.27 S6.3
  Bottom 0.254: J3.40 69.37,43.66 v69.37,40.64 | U$1.G1 82.23,27.94 80.8,29.37 80.8,43.81 J3.50 v76.68,39.85 75.72,38.89 75.72,30.8 73.5,28.57 73.5,25.72 70.09,22.3 | LED1.K 136.84,13.02 136.84,38.26 J5.GND | J3.20 43.18,42.07 36.67,35.56 U$1.G0 | J3.10 29.84,43.81 v29.84,36.67 | S5.3 17.94,2.54 9.53,10.95 9.53,15.88 IC1.9 v2.7,17.78 | 55.72,36.67 55.72,44.29 J3.30 | 55.72,36.67 55.72,35.4 52.39,32.07 52.39,28.42 51.91,27.94 U$1.G6 52.07,27.94 52.07,26.99 53.02,26.04 53.02,6.67 S6.3 | v73.98,17.78 72.23,19.53 72.23,20.32 U$1.G2 72.07,20.32 70.09,22.3 | S7.3 88.9,1.27 97,1.27 97,10.48 97.63,11.11 97.63,17.46 v97.31,17.78 | 55.72,36.67 63.34,36.67 63.34,29.05 70.09,22.3
JOYB1  (via drill 0.38)
  Top 0.254: v85.72,2.7 68.26,2.7 66.83,4.13 51.59,4.13 50.16,2.7 33.18,2.7 30,5.87 21.27,5.87 16.35,10.79 10.64,10.79 2.7,18.73 v2.38,18.73
  Bottom 0.254: v85.72,2.7 86.52,3.49 86.52,3.81 87.95,3.81 91.44,7.3 91.44,12.86 92.08,13.49 92.08,17.14 91.28,17.94 91.28,20.48 90.65,21.11 90.65,23.65 92.39,25.4 U$1.47 | v2.38,18.73 0.95,20.16 0.95,28.89 2.54,30.48 J10.5
JOYB2  (via drill 0.38)
  Top 0.254: v91.28,16.99 91.44,16.83 v93.66,16.83 | v98.9,1.75 v96.2,4.45
  Bottom 0.254: v91.28,16.99 88.74,19.53 88.74,26.67 87.47,27.94 U$1.44 | v93.66,16.83 96.2,14.29 96.2,11.59 95.89,11.27 95.89,9.37 96.2,9.05 v96.2,4.45 | v98.9,1.75 99.22,1.75 100.17,0.79 138.11,0.79 138.11,20.16 138.27,20.32 J11.5
JOYH1
  Top 0.381: U$1.A11 49.21,22.86 47.94,21.59 6.51,21.59 2.7,25.4 J10.3
JOYH2  (via drill 0.38)
  Top 0.381: v92.39,32.38 92.55,32.54 102.23,32.54 102.87,31.91 131.76,31.91 138.27,25.4 J11.3
  Bottom 0.381: v92.39,32.38 92.39,35.56 U$1.31
JOYV1  (via drill 0.38)
  Top 0.381: v46.04,26.19 44.61,27.62 2.86,27.62 2.54,27.94 J10.4
  Bottom 0.381: v46.04,26.19 46.04,23.5 46.67,22.86 U$1.A10
JOYV2  (via drill 0.38)
  Top 0.381: v95.41,31.59 95.89,31.11 130.18,31.11 138.43,22.86 J11.4
  Bottom 0.381: v95.41,31.59 95.41,35.24 95.09,35.56 U$1.32
LED1  (via drill 0.38)
  Top 0.254: v53.98,31.11 53.82,30.96 44.45,30.96 44.29,30.8 25.88,30.8 23.34,33.34 v16.19,33.34 | v16.51,45.09 19.84,48.42 26.51,48.42 J3.7
  Bottom 0.254: v53.98,31.11 55.4,29.69 55.4,26.83 56.83,25.4 U$1.55 | v16.19,33.34 16.51,33.66 v16.51,45.09
LED2  (via drill 0.38)
  Top 0.254: v54.77,43.34 55.09,43.02 61.28,43.02 62.23,43.97 62.23,45.72 v64.45,45.72 | v64.77,49.85 49.21,49.85 48.26,48.9 v42.55,48.9
  Bottom 0.254: v54.77,43.34 53.18,41.75 53.18,35.4 50.64,32.86 50.64,26.51 51.75,25.4 U$1.57 | v64.45,45.72 64.77,46.04 v64.77,49.85 | J3.17 v42.55,48.9
LED3  (via drill 0.38)
  Top 0.254: v44.45,38.89 v42.55,38.89
  Bottom 0.254: v42.55,38.89 39.21,35.56 U$1.0 | v44.45,38.89 49.53,43.97 49.53,44.93 50.32,45.72 52.7,45.72 52.7,46.35 J3.27
LED4  (via drill 0.38)
  Top 0.254: v72.71,26.04 73.98,26.04 74.61,25.4 U$1.53 | v67.47,43.34 67.63,43.18 69.06,43.18 69.85,43.97 69.85,45.72 67.31,45.72 J3.37
  Bottom 0.254: v72.71,26.04 68.1,30.64 68.1,37.78 67.47,38.42 v67.47,43.34
LED5  (via drill 0.38)
  Top 0.254: v69.85,26.83 76.04,26.83 77.15,27.94 U$1.41 | v77.63,49.05 v62.23,49.05
  Bottom 0.254: v69.85,26.83 65.56,31.11 65.56,36.83 61.91,40.48 61.91,43.66 62.23,43.97 v62.23,49.05 | v77.63,49.05 78.74,47.94 J3.47
LED6  (via drill 0.38)
  Top 0.254: v86.2,38.1 87.95,39.85 v91.6,39.85
  Bottom 0.254: v86.2,38.1 86.2,29.21 84.93,27.94 U$1.43 | v91.6,39.85 95.25,43.5 95.25,44.93 94.46,45.72 92.08,45.72 92.08,46.35 J3.57
M_AIN  (via drill 0.38)
  Top 0.254: v95.41,40.16 95.73,40.48 v102.55,40.48
  Bottom 0.254: v95.41,40.16 91.28,36.04 91.28,29.21 90.01,27.94 U$1.45 | v102.55,40.48 103.98,41.91 103.98,44.29 J4.2
M_BIN  (via drill 0.38)
  Top 0.254: v104.78,34.29 v94.14,34.29
  Bottom 0.254: v94.14,34.29 94.14,32.86 92.71,31.43 92.71,28.1 92.55,27.94 U$1.46 | v104.78,34.29 106.52,36.04 106.52,44.29 J4.4
M_PWMA  (via drill 0.38)
  Top 0.254: v99.85,14.92 v91.28,14.92 | v100.97,46.51 101.44,46.99 103.98,46.99 J4.1
  Bottom 0.254: v91.28,14.92 88.27,17.94 88.27,19.53 87.47,20.32 U$1.36 | v99.85,14.92 100.33,15.4 100.33,29.37 100.97,30 v100.97,46.51
M_PWMB  (via drill 0.38)
  Top 0.254: v91.76,26.67 91.92,26.83 95.89,26.83 98.11,29.05 102.71,29.05 v103.82,30.16
  Bottom 0.254: v91.76,26.67 91.28,26.19 91.28,25.24 90.17,24.13 90.17,20.48 90.01,20.32 U$1.35 | v103.82,30.16 103.98,30.32 103.98,41.27 105.25,42.55 105.25,45.72 106.52,46.99 J4.3
N$1
  Bottom 0.254: SW1.2 129.86,7.78 137.16,7.78 137.16,10.16 136.05,11.27 135.25,11.27 135.25,11.75 132.24,14.76 132.24,31.59 130.81,33.02 130.81,38.26 J5.PWR
N$2
  Bottom 0.254: R1.1 131.76,25.72 131.76,14.13 136.05,9.84 LED1.A
N$11  (via drill 0.38)
  Top 0.254: v27.94,28.57 27.3,29.21 RN1.A1
  Bottom 0.254: v27.94,28.57 IC1.18
N$12
  Bottom 0.254: IC1.17 22.86,27.94 RN1.B1
N$13
  Bottom 0.254: IC1.16 20.32,27.94 RN1.C1
N$14
  Bottom 0.254: IC1.15 17.78,27.94 RN1.D1
N$15
  Bottom 0.254: IC1.14 15.24,27.94 RN1.E1
N$16
  Bottom 0.254: IC1.13 14.13,26.51 14.13,27.78 RN1.F1
N$17
  Bottom 0.254: IC1.12 10.16,27.94 RN1.G1
N$18
  Bottom 0.254: IC1.11 7.62,27.94 RN1.H1
N$19
  Top 0.254: RN2.A1 IC2.18
N$20
  Top 0.254: RN2.B1 IC2.17
N$21
  Top 0.254: RN2.C1 IC2.16
N$22
  Top 0.254: RN2.D1 IC2.15
N$23
  Top 0.254: RN2.E1 IC2.14
N$24
  Top 0.254: RN2.G1 IC2.12
N$25
  Top 0.254: RN2.H1 IC2.11
N$26
  Top 0.254: RN2.F1 IC2.13
PWM1  (via drill 0.38)
  Top 0.254: v26.99,31.59 27.46,32.07 v44.93,32.07
  Bottom 0.254: IC1.7 12.06,18.41 12.06,20 8.41,23.65 6.51,23.65 6.51,29.53 8.26,31.27 26.99,31.27 v26.99,31.59 | v44.93,32.07 46.67,33.81 46.67,35.56 U$1.3
PWM2  (via drill 0.38)
  Top 0.254: v40.32,11.27 v23.18,11.27
  Bottom 0.254: IC1.8 10,17.62 10,12.06 10.79,11.27 v23.18,11.27 | v40.32,11.27 48.26,11.27 48.26,17.14 45.4,20 45.4,25.56 44.13,26.83 44.13,35.56 U$1.2
PWM3  (via drill 0.38)
  Top 0.254: IC1.5 19.53,16.03 28.26,16.03 29.84,17.62 35.72,17.62 v35.88,17.46 | v49.05,32.86 v37.94,32.86
  Bottom 0.254: v35.88,17.46 37.94,19.53 v37.94,32.86 | v49.05,32.86 51.75,35.56 U$1.5
PWM4  (via drill 0.38)
  Top 0.254: v11.43,29.53 16.03,34.13 47.78,34.13 49.21,35.56 U$1.4
  Bottom 0.254: IC1.6 13.65,19.37 13.65,26.83 11.43,29.05 v11.43,29.53
PWM5  (via drill 0.38)
  Top 0.254: v42.86,34.92 42.86,36.67 53.18,36.67 54.29,35.56 U$1.6
  Bottom 0.254: IC1.4 23.97,14.13 23.97,8.73 28.89,3.81 30.48,3.81 30.48,2.22 31.43,1.27 37.31,1.27 37.31,11.43 40.48,14.61 40.48,32.54 v42.86,34.92
PWM6  (via drill 0.38)
  Top 0.254: v24.77,10.16 25.08,10.48 v55.24,10.48
  Bottom 0.254: IC1.3 24.77,15.88 v24.77,10.16 | v55.24,10.48 55.4,10.64 55.4,19.68 55.72,20 55.72,22.7 57.94,24.92 57.94,34.61 56.99,35.56 U$1.7
PWM7  (via drill 0.38)
  Top 0.254: v27.94,9.68 58.58,9.68 v59.37,10.48
  Bottom 0.254: v27.94,9.68 IC1.1 | v59.37,10.48 60.96,12.06 60.96,15.72 60.8,15.88 60.8,24.61 61.91,25.72 61.91,35.56 U$1.9
PWM8  (via drill 0.38)
  Top 0.254: v27.94,6.83 28.42,6.35 37.62,6.35 39.69,8.41 v55.24,8.41
  Bottom 0.254: IC1.2 25.4,10.48 27.94,7.94 v27.94,6.83 | v55.24,8.41 56.04,9.21 56.04,11.91 55.88,12.06 55.88,17.62 58.26,20 58.26,22.7 60.48,24.92 60.48,34.61 59.53,35.56 U$1.8
PWM9  (via drill 0.38)
  Top 0.254: v102.55,23.18 101.12,24.61 95.73,24.61 95.41,24.29 92.08,24.29 90.96,25.4 90.96,26.67 76.99,26.67 75.72,25.4 75.72,24.29 v70.01,24.29
  Bottom 0.254: v102.55,23.18 IC2.7 | v70.01,24.29 64.61,29.69 64.61,35.56 U$1.10
PWM10  (via drill 0.38)
  Top 0.254: IC2.8 101.76,14.13 v95.41,14.13 | v93.82,9.84 85.25,9.84 84.93,10.16 v60.48,10.16
  Bottom 0.254: v95.41,14.13 93.82,12.54 v93.82,9.84 | v60.48,10.16 59.69,9.37 58.42,9.37 58.42,19.37 59.37,20.32 U$1.17
PWM11  (via drill 0.38)
  Top 0.254: IC2.6 108.11,15.4 v103.98,15.4 | v101.12,15.4 99.69,16.83 v96.84,16.83 | v96.68,11.11 93.5,11.11 93.19,10.79 85.57,10.79 84.45,11.91 v81.6,11.91
  Bottom 0.254: v101.12,15.4 v103.98,15.4 | v96.84,16.83 96.68,16.67 v96.68,11.11 | v81.6,11.91 80.96,11.27 80.96,10.95 72.71,2.7 67.47,2.7 67.47,14.29 65.72,16.03 65.72,20.8 64.93,21.59 62.07,21.59 62.07,20.32 U$1.16
PWM12  (via drill 0.38)
  Top 0.254: v109.54,9.68 109.22,10 94.61,10 93.98,10.64 93.66,10.64 93.34,10.32 85.41,10.32 84.61,11.11 v80.17,11.11
  Bottom 0.254: IC2.5 109.54,14.29 v109.54,9.68 | v80.17,11.11 75.72,6.67 71.91,6.67 71.91,10.48 67.15,15.24 67.15,20.32 U$1.14
PWM13  (via drill 0.38)
  Top 0.254: IC2.4 113.82,19.53 97.16,19.53 97,19.68 95.89,19.68 95.41,19.21 86.52,19.21 v86.2,19.53
  Bottom 0.254: v86.2,19.53 86.2,28.57 87.31,29.69 87.31,35.56 U$1.29
PWM14  (via drill 0.38)
  Top 0.254: v119.22,37.62 114.78,42.07 v94.93,42.07
  Bottom 0.254: IC2.3 118.59,18.26 118.59,23.81 119.22,24.45 v119.22,37.62 | v94.93,42.07 90.01,37.15 90.01,35.56 U$1.30
PWM15  (via drill 0.38)
  Top 0.254: IC2.2 117.32,21.11 105.25,21.11 104.93,20.8 96.04,20.8 95.41,21.43 93.82,21.43 v93.5,21.11 | v91.44,21.43 83.5,21.43 82.39,20.32 U$1.38
  Bottom 0.254: v93.5,21.11 93.19,21.11 92.87,21.43 v91.44,21.43
PWM16  (via drill 0.38)
  Top 0.254: v115.41,8.1 94.46,8.1 93.19,9.37 v84.77,9.37
  Bottom 0.254: IC2.1 119.38,13.97 119.38,12.06 v115.41,8.1 | v84.77,9.37 84.77,20.32 U$1.37
PWM_1
  Top 0.254: RN1.H2 13.81,43.02 23.18,43.02 24.13,43.97 24.13,46.99 J3.5
PWM_2
  Top 0.254: RN1.G2 15.88,42.55 23.5,42.55 J3.6
PWM_3  (via drill 0.38)
  Top 0.254: RN1.F2 14.13,38.26 32.86,38.26 v36.67,42.07
  Bottom 0.254: v36.67,42.07 36.83,42.23 36.83,45.72 J3.15
PWM_4
  Bottom 0.254: RN1.E2 15.72,37.31 15.72,48.74 18.41,51.44 39.37,51.44 39.37,45.72 J3.16
PWM_5  (via drill 0.38)
  Top 0.254: v14.13,45.24 19.21,50.32 v48.74,50.32
  Bottom 0.254: RN1.D2 16.99,36.04 16.99,33.18 16.35,32.54 14.13,32.54 v14.13,45.24 | v48.74,50.32 50.8,48.26 J3.25
PWM_7  (via drill 0.38)
  Top 0.254: RN1.B2 21.75,35.72 7.3,35.72 6.51,36.51 6.51,47.15 15.08,47.15 19.05,51.12 59.21,51.12 59.69,50.64 v61.91,50.64
  Bottom 0.254: v61.91,50.64 63.5,49.05 J3.35
PWM_8  (via drill 0.38)
  Top 0.254: v26.99,32.86 27.3,33.18 35.56,33.18 v35.88,32.86 | v41.12,39.05 41.75,39.69 61.75,39.69 v62.71,40.64
  Bottom 0.254: RN1.A2 26.99,35.24 v26.99,32.86 | v35.88,32.86 37.94,34.92 37.94,35.88 v41.12,39.05 | v62.71,40.64 63.5,41.43 J3.36
PWM_9  (via drill 0.38)
  Top 0.254: RN2.H2 92.08,36.83 91.76,36.51 90.49,36.51 90.33,36.67 83.98,36.67 v83.82,36.51 | v83.34,38.1 78.74,42.7 v77.95,42.7
  Bottom 0.254: v83.82,36.51 83.34,36.99 v83.34,38.1 | J3.46 v77.95,42.7
PWM_10  (via drill 0.38)
  Top 0.254: v107.31,38.89 104.93,41.27 v97.31,41.27
  Bottom 0.254: RN2.G2 107.31,37.47 v107.31,38.89 | v97.31,41.27 97,41.59 97,48.26 94.14,51.12 71.12,51.12 J3.41
PWM_11  (via drill 0.38)
  Top 0.254: v115.41,49.37 115.25,49.53 95.73,49.53 95.41,49.85 v91.76,49.85
  Bottom 0.254: RN2.E2 114.14,37.94 114.14,42.55 115.41,43.81 v115.41,49.37 | J3.55 v91.76,49.85
PWM_12  (via drill 0.38)
  Top 0.254: RN2.F2 109.22,38.1 v89.53,38.1
  Bottom 0.254: v89.53,38.1 89.53,43.81 J3.56
PWM_13  (via drill 0.38)
  Top 0.254: v98.58,6.83 98.11,6.35 v88.42,6.35
  Bottom 0.254: RN2.D2 111.6,32.86 111.6,20.95 109.06,18.41 109.06,12.06 104.46,7.46 98.9,7.46 98.9,7.14 v98.58,6.83 | v88.42,6.35 82.87,0.79 29.21,0.79 S5.C
PWM_14  (via drill 0.38)
  Top 0.254: v110.33,10.48 98.27,10.48 96.84,11.91 93.66,11.91 93.03,11.27 89.38,11.27 v89.06,11.59
  Bottom 0.254: RN2.C2 116.68,35.4 116.68,16.83 v110.33,10.48 | v89.06,11.59 83.98,6.51 83.98,3.81 81.44,1.27 59.69,1.27 S6.C
PWM_15  (via drill 0.38)
  Top 0.254: v111.28,8.89 110.97,8.57 95.73,8.57 v95.41,8.89
  Bottom 0.254: RN2.B2 121.76,35.72 121.76,20.95 119.06,18.26 119.06,16.67 v111.28,8.89 | v95.41,8.89 93.98,7.46 93.98,6.35 S7.C
PWM_16
  Bottom 0.254: RN2.A2 124.78,35.24 124.78,6.67 S8.C
S1  (via drill 0.38)
  Top 0.254: v101.12,21.75 100.97,21.91 92.55,21.91 92.55,20.32 U$1.34 | J1.3 125.73,48.58 110.65,48.58 109.22,47.15 J4.5
  Bottom 0.254: v101.12,21.75 101.76,22.38 101.76,46.67 103.5,48.42 109.06,48.42 109.06,47.15 J4.5
S2  (via drill 0.38)
  Top 0.254: v106.36,20.32 U$1.33 | v121.28,45.09 124.78,45.09 125.73,46.04 J2.3
  Bottom 0.254: v106.36,20.32 109.06,23.02 109.06,35.72 | 109.06,35.72 109.06,44.29 J4.6 | v121.28,45.09 114.62,38.42 114.62,37.31 114.14,36.83 114.14,36.51 113.35,35.72 109.06,35.72
V+
  Top 0.254: S5.A 30.8,9.21 58.1,9.21 58.5,8.81 | S6.A 58.5,8.81 | 88.98,8.81 88.9,8.89 85.25,8.89 84.93,8.57 62.87,8.57 62.55,8.89 58.58,8.89 58.5,8.81 | 88.98,8.81 S7.A | S8.A 119.38,6.35 112.08,6.35 110.81,7.62 94.3,7.62 93.03,8.89 89.06,8.89 88.98,8.81

### Text on the board
tPlace: 2017 Ali Momeni / Made in PGH | MOL v2-1